# Altium schematic sheet STRWHL-S06-V00-Interface.SchDoc
size A3
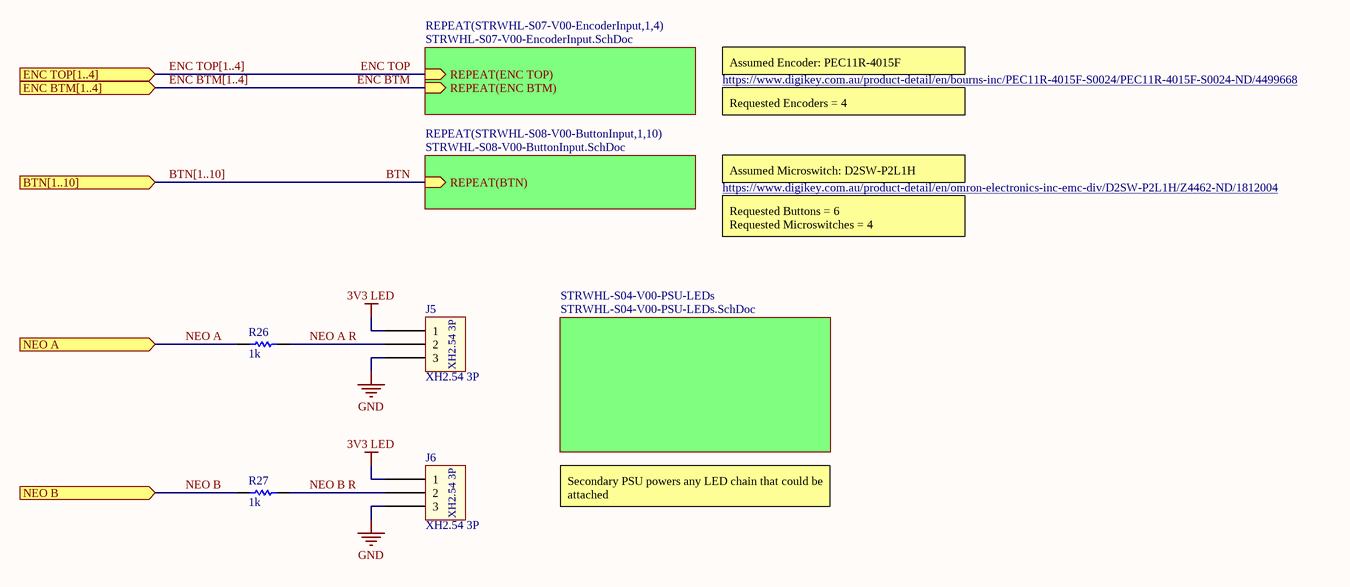
[diagram p0: STRWHL-S06-V00-Interface.SchDoc]

## Parts
J5  XH2.54 3P  [JST_XH254_3P_TH_RH]
J6  XH2.54 3P  [JST_XH254_3P_TH_RH]
R26  1k  [Res_ThinFilm_0603]
R27  1k  [Res_ThinFilm_0603]

## Sub-sheets
REPEAT(STRWHL-S07-V00-EncoderInput,1,4) = STRWHL-S07-V00-EncoderInput.SchDoc: REPEAT(ENC TOP) (in), REPEAT(ENC BTM) (in)
REPEAT(STRWHL-S08-V00-ButtonInput,1,10) = STRWHL-S08-V00-ButtonInput.SchDoc: REPEAT(BTN) (in)
STRWHL-S04-V00-PSU-LEDs = STRWHL-S04-V00-PSU-LEDs.SchDoc: no entries

## Ports
BTN[1..10] (in), ENC BTM[1..4] (in), ENC TOP[1..4] (in), NEO A (in), NEO B (in)

## Nets
3V3 LED: J5.1 J6.1
GND: J5.3 J6.3
BTN: sheet REPEAT(STRWHL-S08-V00-ButtonInput,1,10)/REPEAT(BTN)
ENC BTM: sheet REPEAT(STRWHL-S07-V00-EncoderInput,1,4)/REPEAT(ENC BTM)
ENC TOP: sheet REPEAT(STRWHL-S07-V00-EncoderInput,1,4)/REPEAT(ENC TOP)
NEO A: R26.1 ; port NEO A
NEO A R: J5.2 R26.2
NEO B: R27.1 ; port NEO B
NEO B R: J6.2 R27.2

## Buses and harness runs
bus BTN[1..10] = port BTN[1..10]
bus ENC BTM[1..4] = port ENC BTM[1..4]
bus ENC TOP[1..4] = port ENC TOP[1..4]

## Notes on the sheet
- Assumed Encoder: PEC11R-4015F
- https://www.digikey.com.au/product-detail/en/bourns-inc/PEC11R-4015F-S0024/PEC11R-4015F-S0024-ND/4499668
- Requested Encoders = 4
- https://www.digikey.com.au/product-detail/en/omron-electronics-inc-emc-div/D2SW-P2L1H/Z4462-ND/1812004
- Assumed Microswitch: D2SW-P2L1H
- Requested Buttons = 6
  Requested Microswitches = 4
- Secondary PSU powers any LED chain that could be attached
- Revision History:
- Sheet Title:
- Rev
- Date
- Description
- Project:
- Size:
- Drawn By:
- A3
- Number:
- Revision:
- Sheet
- Version:
- of
- QUT Motorsport
- O-120, Gardens Point
- 2 George Street
- Brisbane, QLD 4000
- Australia
- Print Date:
- Print Time:
- File Name:

## Library data of the parts
R26 R27 = 1k 5% 0603: Resistor, SMD, 1k, 0.1W, 5%, 0603